# EAGLE schematic SOM EVAL BOARD V1.1 (EAGLE 9.4.2)

## Sheet 1 of 3
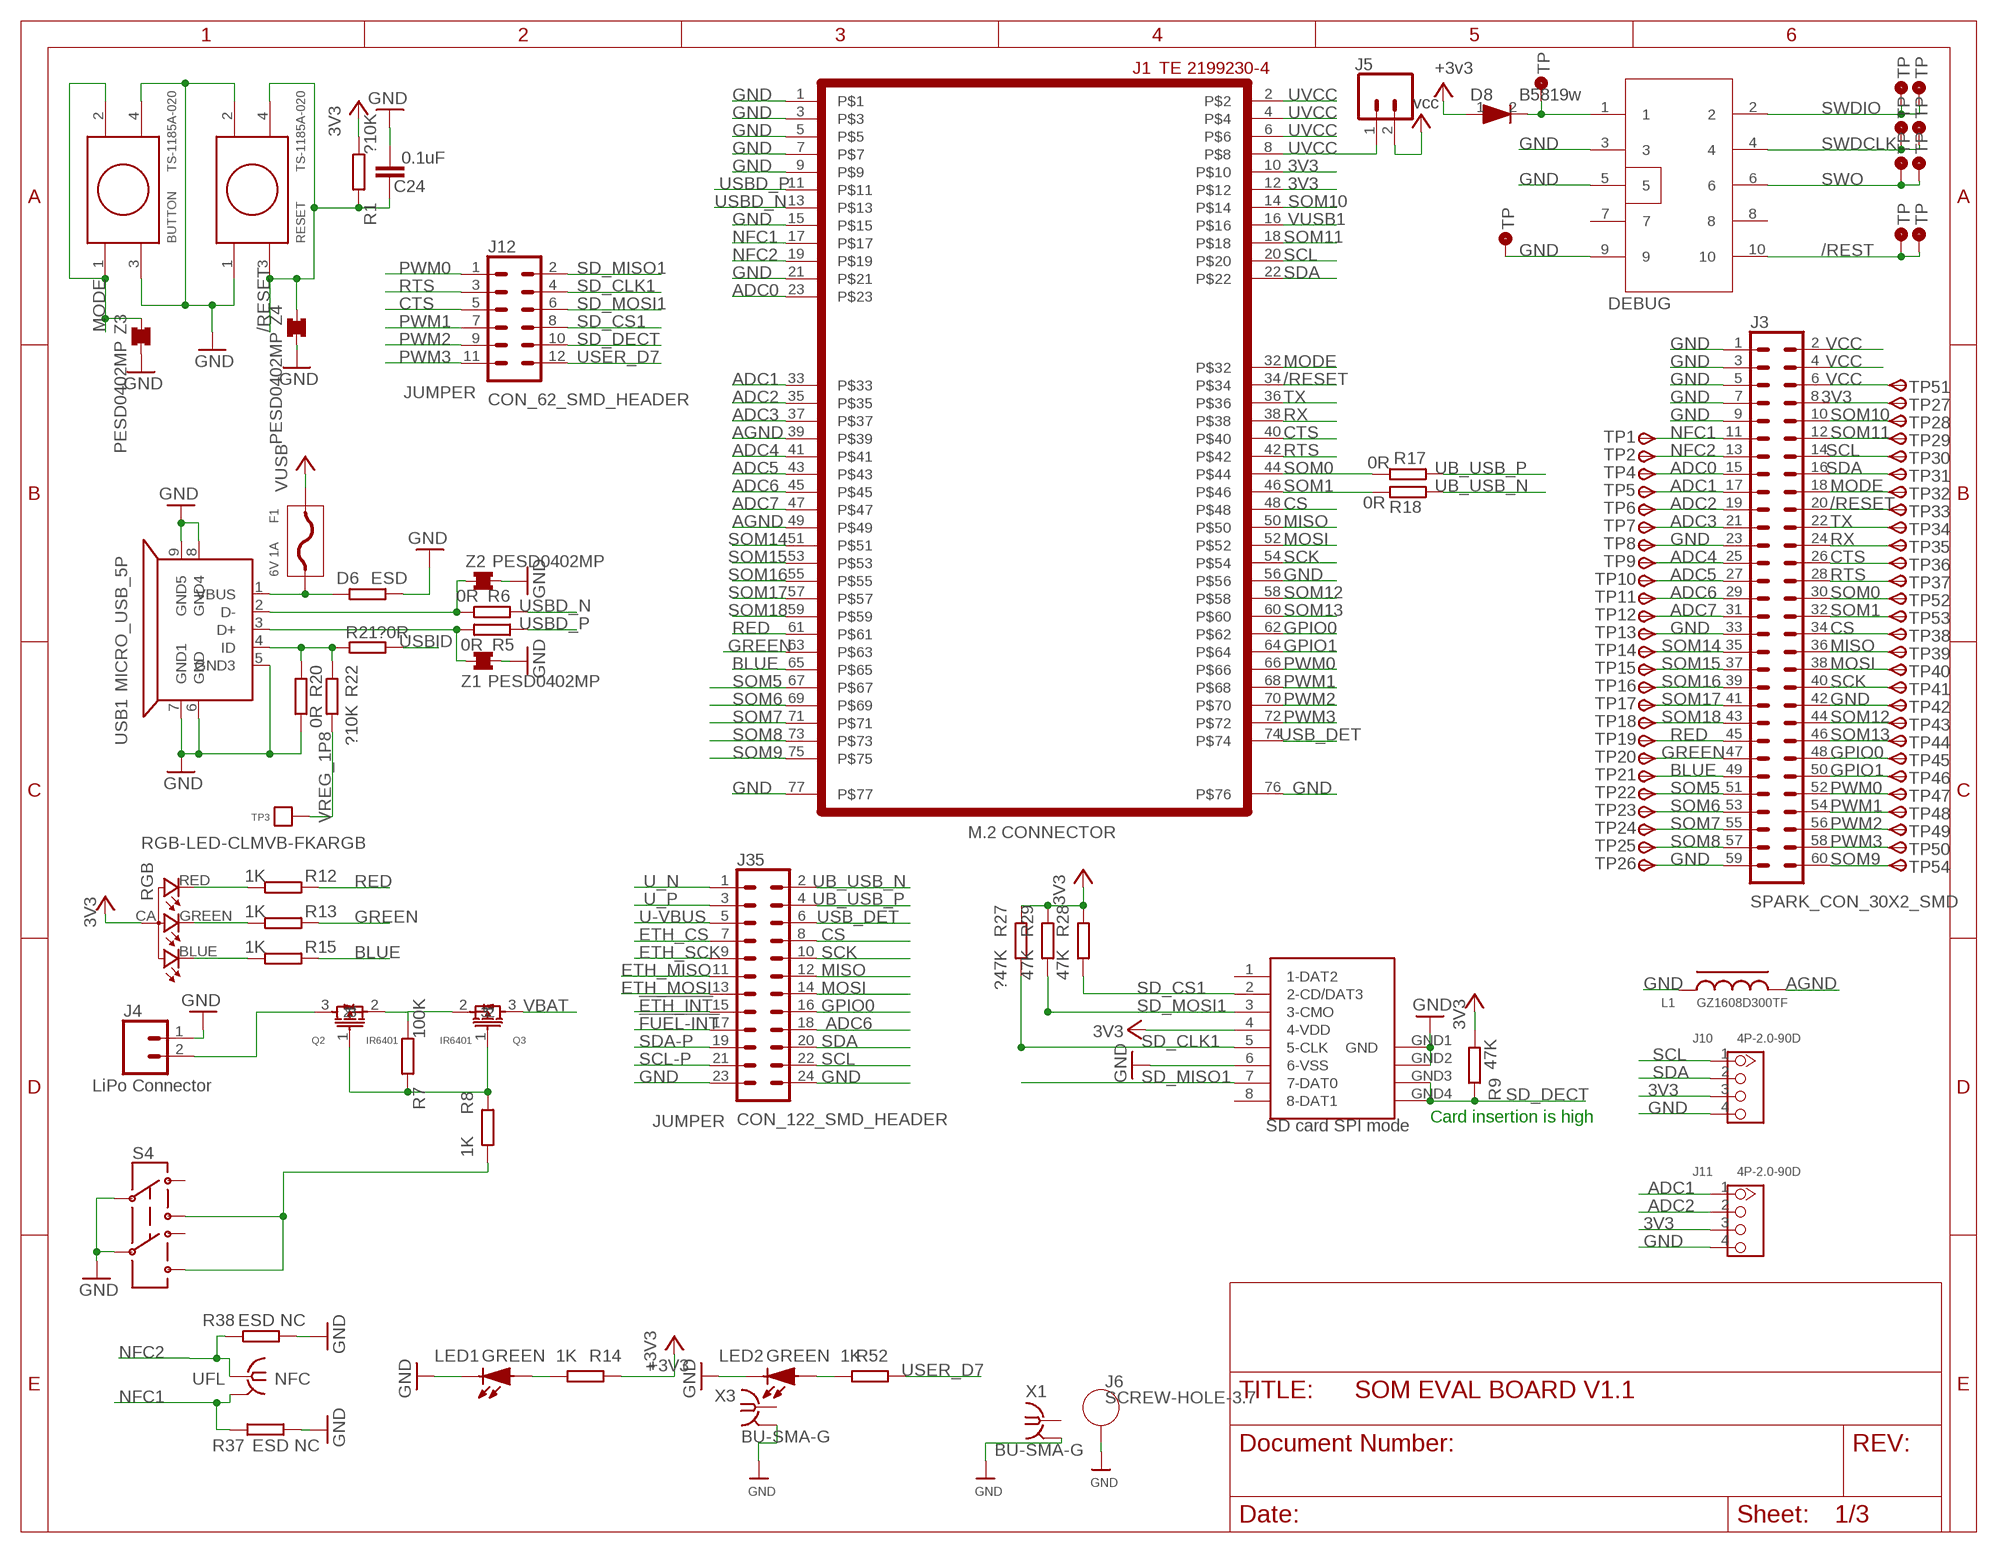
[diagram p0: schematic, sheet 1]

### Parts
BUTTON  TS-1185A-020  [TS-1185A-020]
C24  0.1uF  CAP_1  [C0402_B]
D6  ESD  RES0402S  [R-0402S]
D8  B5819w  DIODESOD123  [SOD-123]
DEBUG  CON5X2  [CON5X2_1.27]
F1  6V 1A  FUSE  [F0805]
J1  TE 2199230-4  M.2EKEY  [M.2EKEY]
J3  SPARK_CON_30X2_SMD  [SPARK_CON_30X2_SMD]
J4  CONN_02-JST-2MM-SMT  [JST-2-SMD]
J5  CONN_02  [1X02]
J6  SCREW-HOLE-3.7  [SCREW-HOLE-3.7]
J10  4P-2.0-90D  GROVE-CONNECTOR-DIP-90D(4P-2.0)  [HW4-2.0-90D]
J11  4P-2.0-90D  GROVE-CONNECTOR-DIP-90D(4P-2.0)  [HW4-2.0-90D]
J12  CON_62_SMD_HEADER  [CON_6*2_SMD_HEADER]
J35  CON_122_SMD_HEADER  [CON_12*2_SMD_HEADER]
L1  GZ1608D300TF  L  [R-0603A]
LED1  GREEN  LED  [LED0603]
LED2  GREEN  LED  [LED0603]
NFC  UFL  IPEX-20279-001E  [IPEX-20279-001E]
P1  SPARK_POGOPIN  [SPARK_POGO-2.0]
P2  SPARK_POGOPIN  [SPARK_POGO-2.0]
P3  SPARK_POGOPIN  [SPARK_POGO-2.0]
P4  SPARK_POGOPIN  [SPARK_POGO-2.0]
Q2  IR6401  PMOS  [SOT-23]
Q3  IR6401  PMOS  [SOT-23]
R1  ?10K  RES0402S  [R-0402S]
R5  0R  RES0402S  [R-0402S]
R6  0R  RES0402S  [R-0402S]
R7  100K  RESR0603  [R0603]
R8  1K  RES0402S  [R-0402S]
R9  47K  RES0402S  [R-0402S]
R12  1K  RES0402S  [R-0402S]
R13  1K  RES0402S  [R-0402S]
R14  1K  RES0402S  [R-0402S]
R15  1K  RES0402S  [R-0402S]
R17  0R  RES0402S  [R-0402S]
R18  0R  RES0402S  [R-0402S]
R20  0R  RES0402S  [R-0402S]
R21  ?0R  RES0402S  [R-0402S]
R22  ?10K  RES0402S  [R-0402S]
R27  ?47K  RES0402S  [R-0402S]
R28  47K  RES0402S  [R-0402S]
R29  47K  RES0402S  [R-0402S]
R37  ESD NC  RES0402S  [R-0402S]
R38  ESD NC  RES0402S  [R-0402S]
R52  1K  RES0402S  [R-0402S]
RESET  TS-1185A-020  [TS-1185A-020]
RGB  RGB-LED-CLMVB-FKARGB  [PLCC4-2MM-RGB]
S4  SWITCH-DPDT  [SWITCH-2.5X3.2-6]
TP1  TPSB1,27  [B1,27]
TP2  TPSB1,27  [B1,27]
TP3  TPTP  [TP]
TP4  TPSB1,27  [B1,27]
TP5  TPSB1,27  [B1,27]
TP6  TPSB1,27  [B1,27]
TP7  TPSB1,27  [B1,27]
TP8  TPSB1,27  [B1,27]
TP9  TPSB1,27  [B1,27]
TP10  TPSB1,27  [B1,27]
TP11  TPSB1,27  [B1,27]
TP12  TPSB1,27  [B1,27]
TP13  TPSB1,27  [B1,27]
TP14  TPSB1,27  [B1,27]
TP15  TPSB1,27  [B1,27]
TP16  TPSB1,27  [B1,27]
TP17  TPSB1,27  [B1,27]
TP18  TPSB1,27  [B1,27]
TP19  TPSB1,27  [B1,27]
TP20  TPSB1,27  [B1,27]
TP21  TPSB1,27  [B1,27]
TP22  TPSB1,27  [B1,27]
TP23  TPSB1,27  [B1,27]
TP24  TPSB1,27  [B1,27]
TP25  TPSB1,27  [B1,27]
TP26  TPSB1,27  [B1,27]
TP27  TPSB1,27  [B1,27]
TP28  TPSB1,27  [B1,27]
TP29  TPSB1,27  [B1,27]
TP30  TPSB1,27  [B1,27]
TP31  TPSB1,27  [B1,27]
TP32  TPSB1,27  [B1,27]
TP33  TPSB1,27  [B1,27]
TP34  TPSB1,27  [B1,27]
TP35  TPSB1,27  [B1,27]
TP36  TPSB1,27  [B1,27]
TP37  TPSB1,27  [B1,27]
TP38  TPSB1,27  [B1,27]
TP39  TPSB1,27  [B1,27]
TP40  TPSB1,27  [B1,27]
TP41  TPSB1,27  [B1,27]
TP42  TPSB1,27  [B1,27]
TP43  TPSB1,27  [B1,27]
TP44  TPSB1,27  [B1,27]
TP45  TPSB1,27  [B1,27]
TP46  TPSB1,27  [B1,27]
TP47  TPSB1,27  [B1,27]
TP48  TPSB1,27  [B1,27]
TP49  TPSB1,27  [B1,27]
TP50  TPSB1,27  [B1,27]
TP51  TPSB1,27  [B1,27]
TP52  TPSB1,27  [B1,27]
TP53  TPSB1,27  [B1,27]
TP54  TPSB1,27  [B1,27]
U$1  TP2  [TP70_BOT]
U$2  TP2  [TP70_BOT]
U$9  TP2  [TP70_BOT]
U$10  TP2  [TP70_BOT]
U$11  TP2  [TP70_BOT]
U$12  TP2  [TP70_BOT]
USB1  MICRO_USB_5P  MICRO_USBMICRO_USB  [MICRO_USB]
X1  BU-SMA-G  [BU-SMA-G]
X3  BU-SMA-G  [BU-SMA-G]
X4  0046_15TW-882  [SDCARD-15TW-8821]
Z1  PESD0402MP  [SMD-0402MP]
Z2  PESD0402MP  [SMD-0402MP]
Z3  PESD0402MP  [SMD-0402MP]
Z4  PESD0402MP  [SMD-0402MP]

### Nets
3V3: J1.10 J1.12 J3.8 J10.3 J11.3 R1.2 R9.2 R27.1 R28.1 R29.1 RGB.CA TP27.TP(PP) X4.4(4-VDD) ; also sheet 2
!ETH_INT: J35.15 ; also sheet 3
!FUEL-INT: J35.17 ; also sheet 2
+3V3: D8.1 R14.1 ; supply symbol labelled +3v3 ; also sheet 2,3
/RESET: C24.2 J1.34 J3.20 R1.1 RESET.3 RESET.4 TP33.TP(PP) Z4.2
/REST: DEBUG.10 P4.P$2(TP) U$12.P$1(TP)
ADC0: J1.23 J3.15 TP4.TP(PP)
ADC1: J1.33 J3.17 J11.1 TP5.TP(PP)
ADC2: J1.35 J3.19 J11.2 TP6.TP(PP)
ADC3: J1.37 J3.21 TP7.TP(PP)
ADC4: J1.41 J3.25 TP9.TP(PP)
ADC5: J1.43 J3.27 TP10.TP(PP)
ADC6: J1.45 J3.29 J35.18 TP11.TP(PP)
ADC7: J1.47 J3.31 TP12.TP(PP) ; also sheet 3
AGND: J1.39 J1.49 L1.2
BLUE: J1.65 J3.49 R15.1 TP21.TP(PP)
CS: J1.48 J3.34 J35.8 TP38.TP(PP)
CTS: J1.40 J3.26 J12.5 TP36.TP(PP)
D+: R5.2 USB1.3(D+) Z1.2
D-: R6.2 USB1.2(D-) Z2.2
ETH_CS: J35.7 ; also sheet 3
ETH_MISO: J35.11 ; also sheet 3
ETH_MOSI: J35.13 ; also sheet 3
ETH_SCK: J35.9 ; also sheet 3
GND: BUTTON.3 BUTTON.4 C24.1 D6.1 DEBUG.3 DEBUG.5 DEBUG.9 J1.1 J1.3 J1.5 J1.7 J1.9 J1.15 J1.21 J1.56 J1.76 J1.77 J3.1 J3.3 J3.5 J3.7 J3.9 J3.23 J3.33 J3.42 J3.59 J4.1 J6.P$1(GND) J10.4 J11.4 J35.23 J35.24 L1.1 LED1.2(K) LED2.2(K) R20.2 R37.2 R38.1 RESET.1 RESET.2 S4.2 S4.5 TP8.TP(PP) TP13.TP(PP) TP26.TP(PP) TP42.TP(PP) U$2.P$1(TP) USB1.5(GND3) USB1.6(GND) USB1.7(GND1) USB1.8(GND4) USB1.9(GND5) X1.2 X1.3 X1.4 X1.5 X3.2 X3.3 X3.4 X3.5 X4.6(6-VSS) X4.GND1(GND) X4.GND2(GND1) Z1.1 Z2.1 Z3.1 Z4.1 ; also sheet 2,3
GPIO0: J1.62 J3.48 J35.16 TP45.TP(PP)
GPIO1: J1.64 J3.50 TP46.TP(PP)
GREEN: J1.63 J3.47 R13.1 TP20.TP(PP)
MISO: J1.50 J3.36 J35.12 TP39.TP(PP)
MODE: BUTTON.1 BUTTON.2 J1.32 J3.18 TP32.TP(PP) Z3.2
MOSI: J1.52 J3.38 J35.14 TP40.TP(PP)
N$1: R20.1 R21.1 R22.1 USB1.4(ID)
N$2: R12.2 RGB.RED
N$9: R8.2 S4.3 S4.6
N$10: D8.2 DEBUG.1 U$1.P$1(TP)
N$14: J4.2 Q2.3
N$18: D6.2 F1.P$1 USB1.1(VBUS)
N$19: LED1.1(A) R14.2
N$26: R15.2 RGB.BLUE
N$27: R13.2 RGB.GREEN
N$36: LED2.1(A) R52.2
N$46: Q2.2 Q3.2 R7.2
N$47: Q2.1 Q3.1 R7.1 R8.1
NFC1: J1.17 J3.11 NFC.2@1(GND) NFC.2@2(GND) R37.1 TP1.TP(PP)
NFC2: J1.19 J3.13 NFC.1 R38.2 TP2.TP(PP)
PWM0: J1.66 J3.52 J12.1 TP47.TP(PP)
PWM1: J1.68 J3.54 J12.7 TP48.TP(PP)
PWM2: J1.70 J3.56 J12.9 TP49.TP(PP)
PWM3: J1.72 J3.58 J12.11 TP50.TP(PP)
RED: J1.61 J3.45 R12.1 TP19.TP(PP)
RTS: J1.42 J3.28 J12.3 TP37.TP(PP)
RX: J1.38 J3.24 TP35.TP(PP)
SCK: J1.54 J3.40 J35.10 TP41.TP(PP)
SCL: J1.20 J3.14 J10.1 J35.22 TP30.TP(PP)
SCL-P: J35.21 ; also sheet 2
SD_CLK1: J12.4 R27.2 X4.5(5-CLK)
SD_CS1: J12.8 R28.2 X4.2(2-CD/DAT3)
SD_DECT: J12.10 R9.1 X4.GND3(GND2) X4.GND4(GND3)
SD_MISO1: J12.2 X4.7(7-DAT0)
SD_MOSI1: J12.6 R29.2 X4.3(3-CMO)
SDA: J1.22 J3.16 J10.2 J35.20 TP31.TP(PP)
SDA-P: J35.19 ; also sheet 2
SOM0: J1.44 J3.30 R17.2 TP52.TP(PP)
SOM1: J1.46 J3.32 R18.2 TP53.TP(PP)
SOM5: J1.67 J3.51 TP22.TP(PP)
SOM6: J1.69 J3.53 TP23.TP(PP)
SOM7: J1.71 J3.55 TP24.TP(PP)
SOM8: J1.73 J3.57 TP25.TP(PP)
SOM9: J1.75 J3.60 TP54.TP(PP)
SOM10: J1.14 J3.10 TP28.TP(PP)
SOM11: J1.18 J3.12 TP29.TP(PP)
SOM12: J1.58 J3.44 TP43.TP(PP)
SOM13: J1.60 J3.46 TP44.TP(PP)
SOM14: J1.51 J3.35 TP14.TP(PP)
SOM15: J1.53 J3.37 TP15.TP(PP)
SOM16: J1.55 J3.39 TP16.TP(PP)
SOM17: J1.57 J3.41 TP17.TP(PP)
SOM18: J1.59 J3.43 TP18.TP(PP)
SWDCLK: DEBUG.4 P2.P$2(TP) U$10.P$1(TP)
SWDIO: DEBUG.2 P1.P$2(TP) U$9.P$1(TP)
SWO: DEBUG.6 P3.P$2(TP) U$11.P$1(TP)
TX: J1.36 J3.22 TP34.TP(PP)
U-VBUS: J35.5 ; also sheet 2
U_N: J35.1 ; also sheet 2
U_P: J35.3 ; also sheet 2
UB_USB_N: J35.2 R18.1
UB_USB_P: J35.4 R17.1
USB_DET: J1.74 J35.6
USBD_N: J1.13 R6.1 ; also sheet 2
USBD_P: J1.11 R5.1 ; also sheet 2
USBID: R21.2
USER_D7: J12.12 R52.1
UVCC: J1.2 J1.4 J1.6 J1.8 J5.1
VBAT: Q3.3 ; also sheet 2
VCC: J3.2 J3.4 J3.6 J5.2 TP51.TP(PP) ; supply symbol labelled vcc ; also sheet 2
VREG_1P8: R22.2 TP3.P$1
VUSB: F1.P$2 ; also sheet 2
VUSB1: J1.16 ; also sheet 2
Unconnected: DEBUG.7 DEBUG.8 S4.1 S4.4 X1.1 X3.1 X4.1(1-DAT2) X4.8(8-DAT1)

### Notes on the sheet
- JUMPER
- M.2 CONNECTOR
- LiPo Connector
- JUMPER | Card insertion is high
- SD card SPI mode

## Sheet 2 of 3
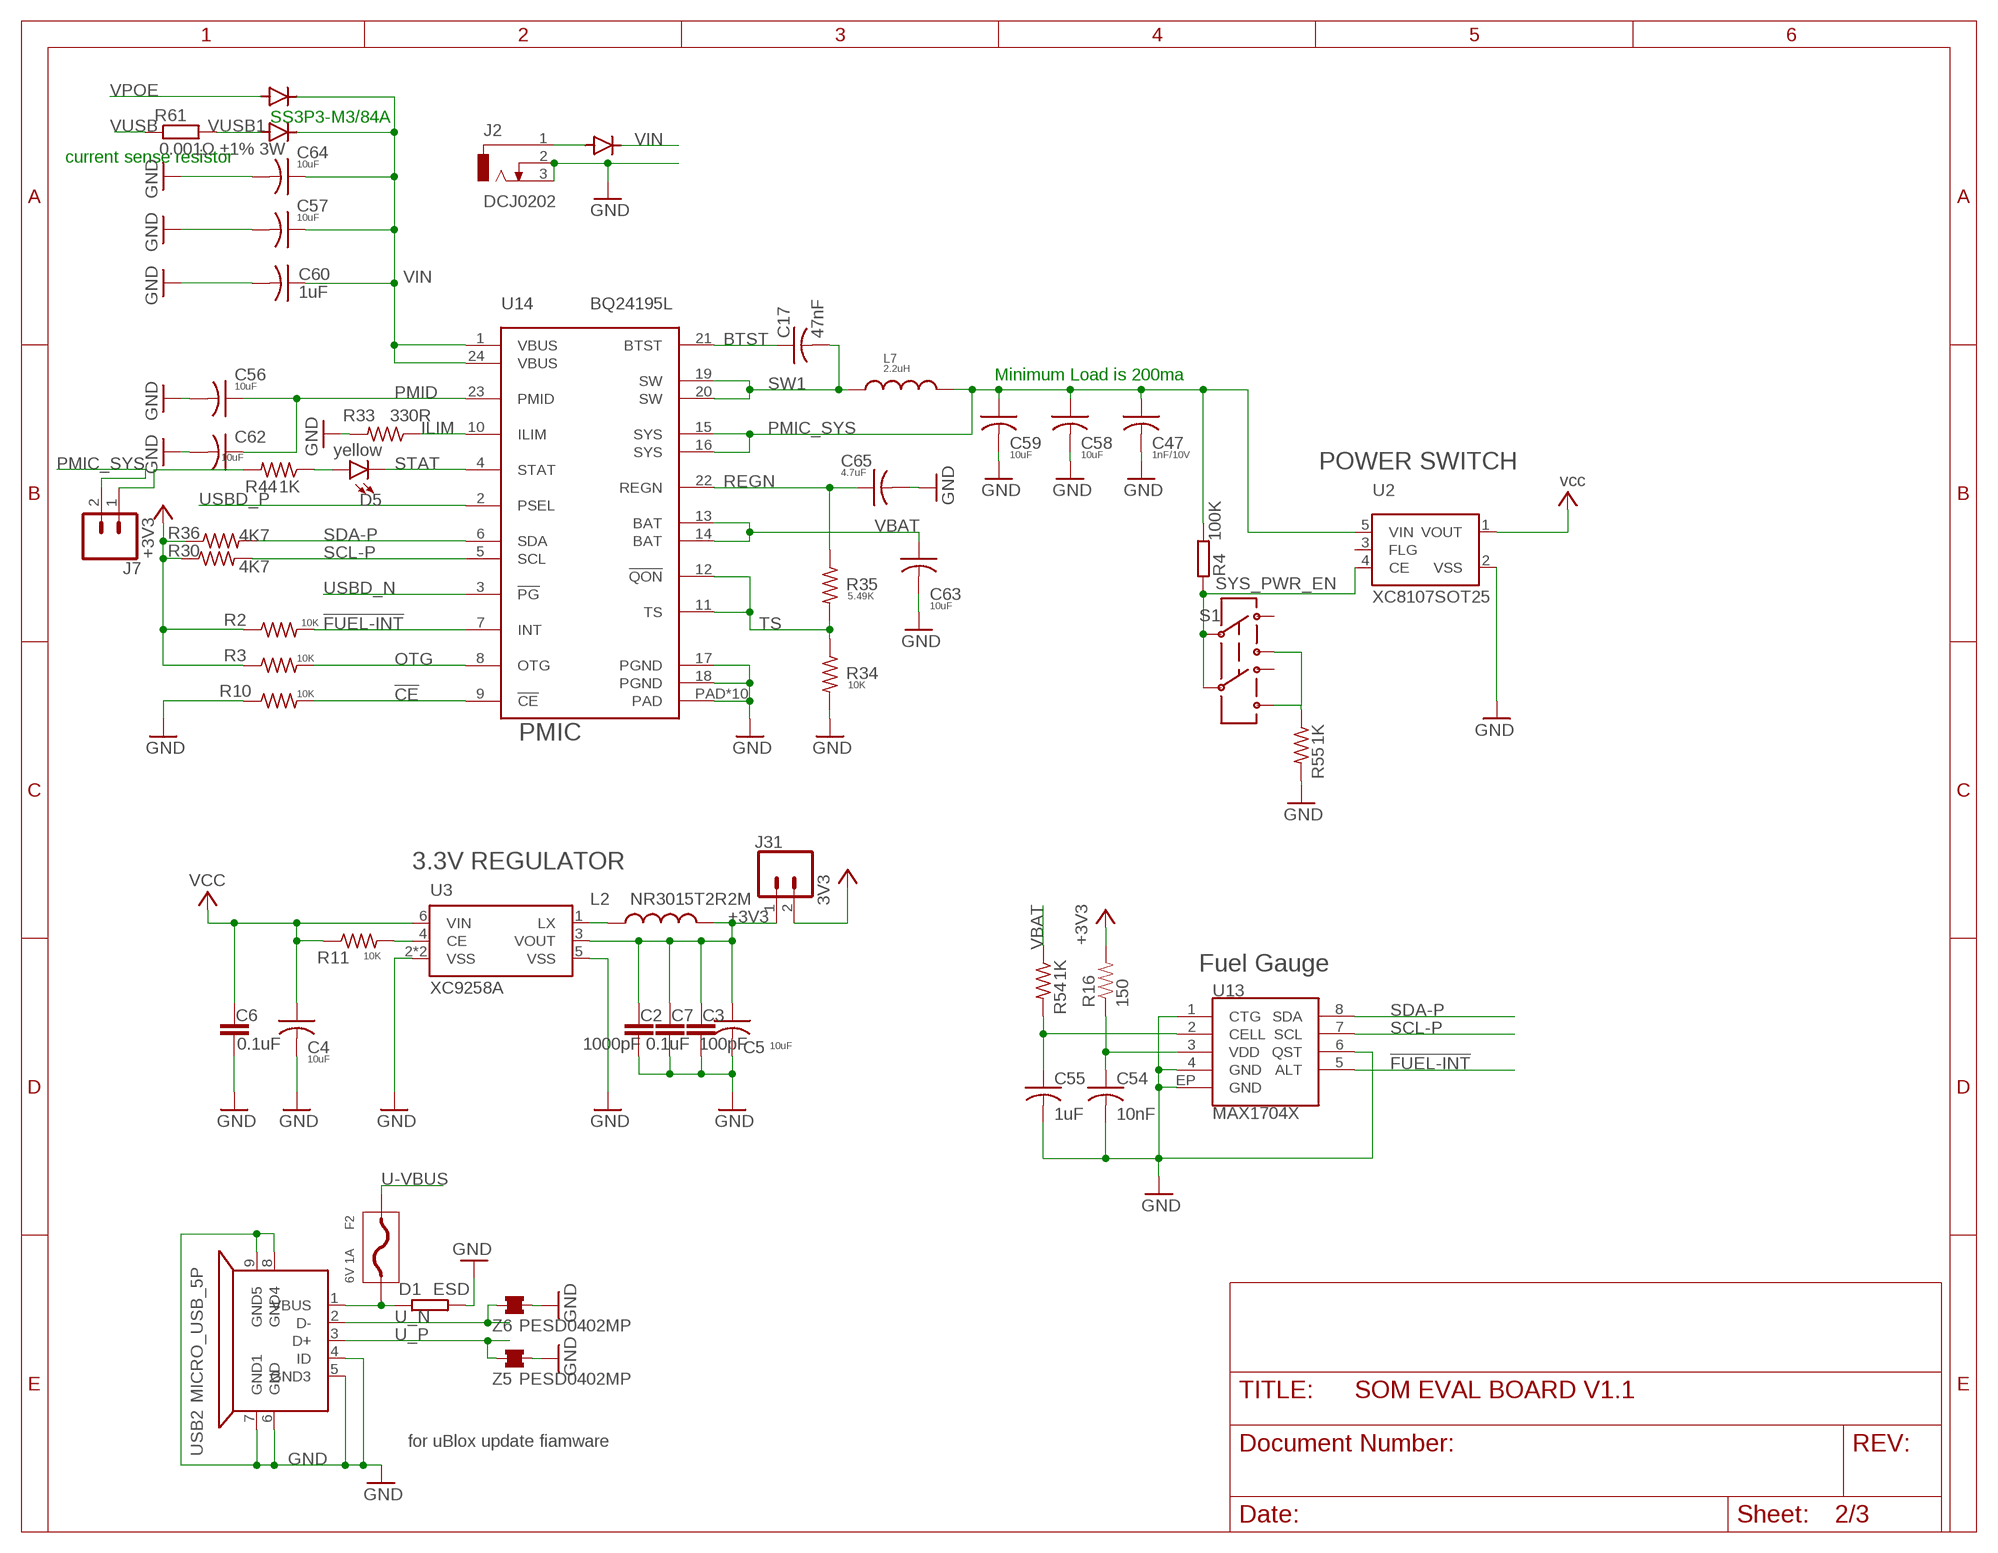
[diagram p1: schematic, sheet 2]

### Parts
C2  1000pF  CAP_1  [C0402_B]
C3  100pF  CAP_1  [C0402_B]
C4  10uF  C-US0603  [C0603_B]
C5  10uF  C-US0603  [C0603_B]
C6  0.1uF  CAP_1  [C0402_B]
C7  0.1uF  CAP_1  [C0402_B]
C17  47nF  C-USC0201_B  [C0201_B]
C47  1nF/10V  C-US0402  [C0402_B]
C54  10nF  C-US  [C0402_B]
C55  1uF  C-US  [C0402_B]
C56  10uF  C-US0603  [C0603_B]
C57  10uF  C-US0603  [C0603_B]
C58  10uF  C-US0603  [C0603_B]
C59  10uF  C-US0603  [C0603_B]
C60  1uF  C-US  [C0402_B]
C62  10uF  C-US0603  [C0603_B]
C63  10uF  C-US0603  [C0603_B]
C64  10uF  C-US0603  [C0603_B]
C65  4.7uF  C-US0603  [C0603_B]
D1  ESD  RES0402S  [R-0402S]
D3  SS3P3-M3/84A  DIODE_NT  [DIODE-DO-220AA_NT(SMP)]
D4  SS3P3-M3/84A  DIODE_NT  [DIODE-DO-220AA_NT(SMP)]
D5  yellow  LED-RED0603  [LED-0603]
D7  SS3P3-M3/84A  DIODE_NT  [DIODE-DO-220AA_NT(SMP)]
F2  6V 1A  FUSE  [F0805]
J2  DCJ0202  [DCJ0202]
J7  CONN_02  [1X02]
J31  CONN_02  [1X02]
L2  NR3015T2R2M  INDUCTOR-SPARKFUNVLS3012ET-4R7M  [INDUCTOR-VLS-E]
L7  2.2uH  INDUCTORI  [INDUCTOR-4040]
R2  10K  R-US_  [R0402_B]
R3  10K  R-US_  [R0402_B]
R4  100K  RESR0603  [R0603]
R10  10K  R-US_  [R0402_B]
R11  10K  R-US_  [R0402_B]
R16  150  RESISTOR0402-RES  [0402-RES]
R30  4K7  R-US_R0201_B  [C0201_B]
R33  330R  R-US_  [R0402_B]
R34  10K  R-US_  [R0402_B]
R35  5.49K  R-US_  [R0402_B]
R36  4K7  R-US_R0201_B  [C0201_B]
R44  1K  R-US_  [R0402_B]
R54  1K  R-US_  [R0402_B]
R55  1K  R-US_  [R0402_B]
R61  0.001Ω ±1% 3W  R-EU_R2512  [R2512]
S1  SWITCH-DPDT  [SWITCH-2.5X3.2-6]
U2  XC8107SOT25  [SOT25]
U3  XC9258A  XC9258A33EER-G  [USP-6C]
U13  MAX1704X  [TDFN-8]
U14  BQ24195L  BQ24298RTWR  [QFN24]
USB2  MICRO_USB_5P  MICRO_USBMICRO_USB  [MICRO_USB]
Z5  PESD0402MP  [SMD-0402MP]
Z6  PESD0402MP  [SMD-0402MP]

### Nets
3V3: J31.2 ; also sheet 1
!CE: R10.2 U14.9(!CE)
!FUEL-INT: R2.2 U13.5(ALT) U14.7(INT) ; also sheet 1
+3V3: C2.2 C3.2 C5.1 C7.2 J31.1 L2.P$2 R2.1 R3.1 R16.2 R30.1 R36.1 U3.3(VOUT) ; also sheet 1,3
BTST: C17.1 U14.21(BTST)
GND: C2.1 C3.1 C4.2 C5.2 C6.1 C7.1 C47.2 C54.2 C55.2 C56.2 C57.2 C58.2 C59.2 C60.2 C62.2 C63.2 C64.2 C65.2 D1.1 J2.2 J2.3 R10.1 R33.2 R34.2 R55.2 U2.2(VSS) U3.2(VSS) U3.5(VSS) U3.P$1(VSS) U13.1(CTG) U13.4(GND) U13.6(QST) U13.EP(GND) U14.17(PGND) U14.18(PGND) U14.PAD U14.PAD@1(PAD) U14.PAD@2(PAD) U14.PAD@3(PAD) U14.PAD@4(PAD) U14.PAD@5(PAD) U14.PAD@6(PAD) U14.PAD@7(PAD) U14.PAD@8(PAD) U14.PAD@9(PAD) USB2.4(ID) USB2.5(GND3) USB2.6(GND) USB2.7(GND1) USB2.8(GND4) USB2.9(GND5) Z5.1 Z6.1 ; also sheet 1,3
ILIM: R33.1 U14.10(ILIM)
N$3: D5.A R44.1
N$4: J7.1 R44.2
N$5: D1.2 F2.P$1 USB2.1(VBUS)
N$6: L2.P$1 U3.1(LX)
N$7: R11.2 U3.4(CE)
N$38: R55.1 S1.3 S1.6
N$45: D7.ANODE J2.1
N$48: C54.1 R16.1 U13.3(VDD)
N$49: C55.1 R54.2 U13.2(CELL)
OTG: R3.2 U14.8(OTG)
PMIC_SYS: C47.1 C58.1 C59.1 J7.2 L7.P$2 R4.2 U2.5(VIN) U14.15(SYS) U14.16(SYS)
PMID: C56.1 C62.1 U14.23(PMID)
REGN: C65.1 R35.1 U14.22(REGN)
SCL-P: R30.2 U13.7(SCL) U14.5(SCL) ; also sheet 1
SDA-P: R36.2 U13.8(SDA) U14.6(SDA) ; also sheet 1
STAT: D5.C U14.4(STAT)
SW1: C17.2 L7.P$1 U14.19(SW) U14.20(SW)
SYS_PWR_EN: R4.1 S1.2 S1.5 U2.4(CE)
TS: R34.1 R35.2 U14.11(TS) U14.12(!QON)
U-VBUS: F2.P$2 ; also sheet 1
U_N: USB2.2(D-) Z6.2 ; also sheet 1
U_P: USB2.3(D+) Z5.2 ; also sheet 1
USBD_N: U14.3(!PG) ; also sheet 1
USBD_P: U14.2(PSEL) ; also sheet 1
VBAT: C63.1 R54.1 U14.13(BAT) U14.14(BAT) ; also sheet 1
VCC: C4.1 C6.2 R11.1 U2.1(VOUT) U3.6(VIN) ; supply symbol labelled vcc ; also sheet 1
VIN [power]: C57.1 C60.1 C64.1 D3.CATHODE D4.CATHODE D7.CATHODE U14.1(VBUS) U14.24(VBUS)
VPOE: D3.ANODE ; also sheet 3
VUSB: R61.1 ; also sheet 1
VUSB1: D4.ANODE R61.2 ; also sheet 1
Unconnected: S1.1 S1.4 U2.3(FLG)

### Notes on the sheet
- SS3P3-M3/84A
- current sense resistor
- Minimum Load is 200ma
- POWER SWITCH
- PMIC
- 3.3V REGULATOR
- Fuel Gauge
- for uBlox update fiamware

## Sheet 3 of 3
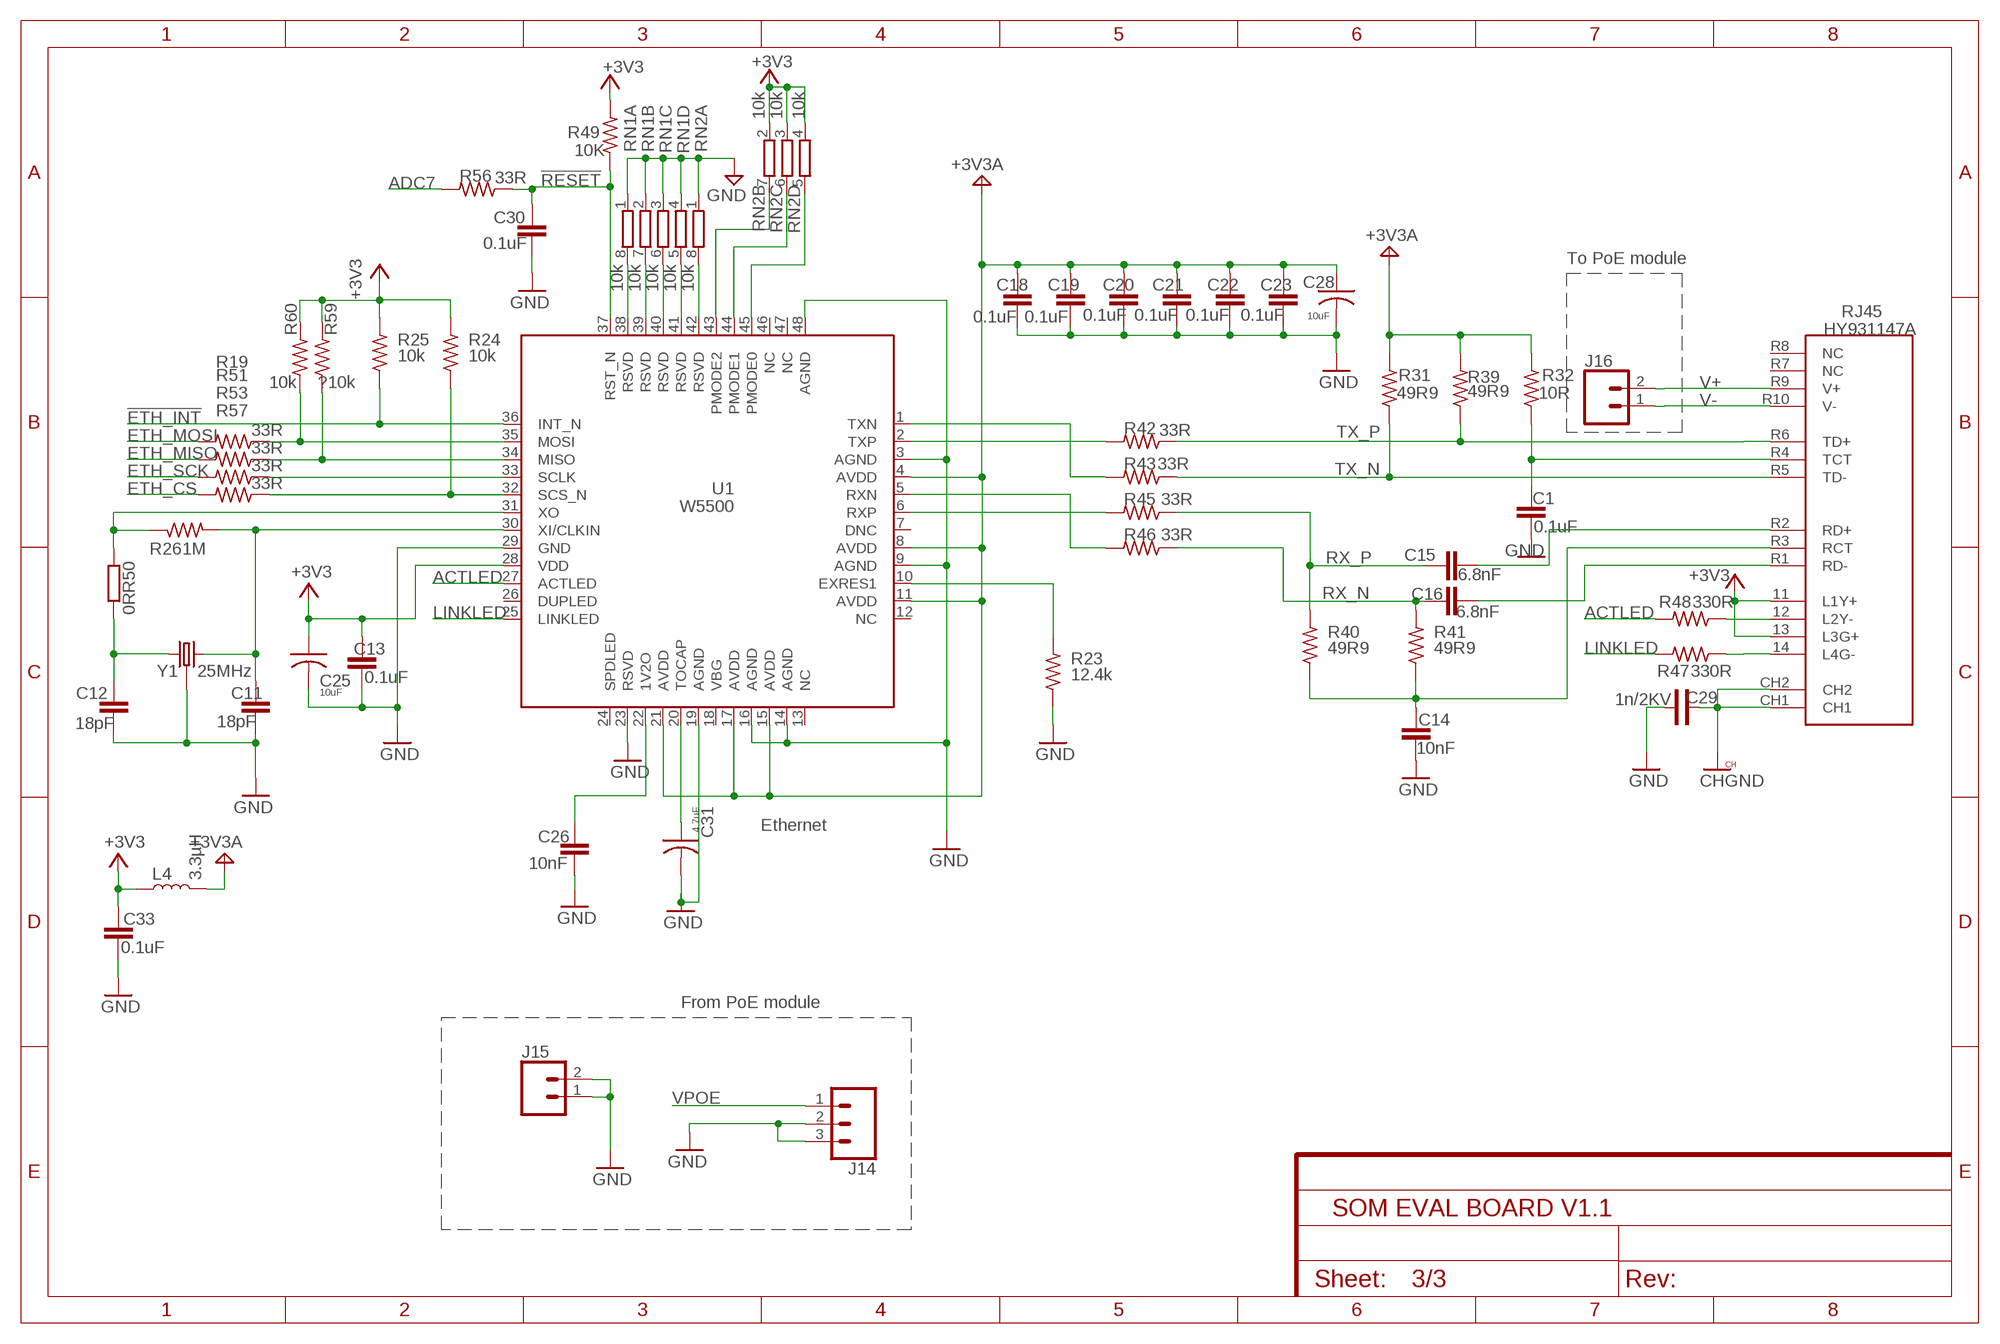
[diagram p2: schematic, sheet 3]

### Parts
C1  0.1uF  CAP_1  [C0402_B]
C11  18pF  CAP_1  [C0402_B]
C12  18pF  CAP_1  [C0402_B]
C13  0.1uF  CAP_1  [C0402_B]
C14  10nF  CAP_1  [C0402_B]
C15  6.8nF  CAP_1  [C0402_B]
C16  6.8nF  CAP_1  [C0402_B]
C18  0.1uF  CAP_1  [C0402_B]
C19  0.1uF  CAP_1  [C0402_B]
C20  0.1uF  CAP_1  [C0402_B]
C21  0.1uF  CAP_1  [C0402_B]
C22  0.1uF  CAP_1  [C0402_B]
C23  0.1uF  CAP_1  [C0402_B]
C25  10uF  C-US0603  [C0603_B]
C26  10nF  CAP_1  [C0402_B]
C28  10uF  C-US0603  [C0603_B]
C29  1n/2KV  C-1808  [C-1808]
C30  0.1uF  CAP_1  [C0402_B]
C31  4.7uF  C-US0603  [C0603_B]
C33  0.1uF  CAP_1  [C0402_B]
J14  CONN_03  [1X03]
J15  CONN_02  [1X02]
J16  CONN_02  [1X02]
L4  3.3µH  INDUCTOR-0805-3.3UH  [0805]
R19  33R  R-US_  [R0402_B]
R23  12.4k  R-US_  [R0402_B]
R24  10k  R-US_  [R0402_B]
R25  10k  R-US_  [R0402_B]
R26  1M  R-US_  [R0402_B]
R31  49R9  R-US_  [R0402_B]
R32  10R  R-US_  [R0402_B]
R39  49R9  R-US_  [R0402_B]
R40  49R9  R-US_  [R0402_B]
R41  49R9  R-US_  [R0402_B]
R42  33R  R-US_  [R0402_B]
R43  33R  R-US_  [R0402_B]
R45  33R  R-US_  [R0402_B]
R46  33R  R-US_  [R0402_B]
R47  330R  R-US_  [R0402_B]
R48  330R  R-US_  [R0402_B]
R49  10K  R-US_  [R0402_B]
R50  0R  RES0402S  [R-0402S]
R51  33R  R-US_  [R0402_B]
R53  33R  R-US_  [R0402_B]
R56  33R  R-US_  [R0402_B]
R57  33R  R-US_  [R0402_B]
R59  ?10k  R-US_  [R0402_B]
R60  10k  R-US_  [R0402_B]
RJ45  HY931147A  ARDUINO-ETHERNET-SHIELD2-V2_POE_RJ45  [ARDUINO-ETHERNET-SHIELD2-V2_CONNETTORI_POE-RJ45]
RN1  10k  4R-N0402ARV341  [4X0402ARV341]
RN2  10k  4R-N0402ARV341  [4X0402ARV341]
U1  W5500  [W5500]
Y1  25MHz  CRYSTAL-GROUNDEDSMD-3.2X2.5  [CRYSTAL-SMD-3.2X2.5MM]

### Nets
!ETH_INT: R25.1 U1.36(INT_N) ; also sheet 1
!RESET: C30.2 R49.1 R56.1 U1.37(RST_N)
+3V3: C13.2 C25.1 C33.2 L4.1 R24.2 R25.2 R49.2 R59.2 R60.2 RJ45.11(L1Y+) RJ45.13(L3G+) RN2.2 RN2.3 RN2.4 U1.28(VDD) ; also sheet 1,2
+3V3A: C18.2 C19.2 C20.2 C21.2 C22.2 C23.2 C28.1 L4.2 R31.2 R32.2 R39.2 U1.4(AVDD) U1.8(AVDD) U1.11(AVDD) U1.15(AVDD) U1.17(AVDD) U1.21(AVDD)
ACTLED: R48.2 U1.27(ACTLED)
ADC7: R56.2 ; also sheet 1
CHGND: C29.P$1 RJ45.CH1 RJ45.CH2
ETH_CS: R57.2 ; also sheet 1
ETH_MISO: R51.2 ; also sheet 1
ETH_MOSI: R19.2 ; also sheet 1
ETH_SCK: R53.2 ; also sheet 1
GND: C1.1 C11.1 C12.1 C13.1 C14.1 C18.1 C19.1 C20.1 C21.1 C22.1 C23.1 C25.2 C26.1 C28.2 C29.P$2 C30.1 C31.2 C33.1 J14.2 J14.3 J15.1 J15.2 R23.1 RN1.1 RN1.2 RN1.3 RN1.4 RN2.1 U1.3(AGND) U1.9(AGND) U1.14(AGND) U1.16(AGND) U1.19(AGND) U1.23(RSVD) U1.29(GND) U1.48(AGND) Y1.2 Y1.4 ; also sheet 1,2
LINKLED: R47.2 U1.25(LINKLED)
N$8: R19.1 R60.1 U1.35(MOSI)
N$11: R51.1 R59.1 U1.34(MISO)
N$12: RN1.8 U1.38(RSVD)
N$13: R53.1 U1.33(SCLK)
N$15: RN1.7 U1.39(RSVD)
N$16: RN1.6 U1.40(RSVD)
N$17: RN1.5 U1.41(RSVD)
N$20: RN2.8 U1.42(RSVD)
N$21: R24.1 R57.1 U1.32(SCS_N)
N$22: RN2.7 U1.43(PMODE2)
N$23: RN2.6 U1.44(PMODE1)
N$24: RN2.5 U1.45(PMODE0)
N$25: C26.2 U1.22(1V2O)
N$28: R23.2 U1.10(EXRES1)
N$29: C1.2 R32.1 RJ45.R4(TCT)
N$30: C14.2 R40.1 R41.1 RJ45.R3(RCT)
N$31: R26.1 R50.1 U1.31(XO)
N$32: C11.2 R26.2 U1.30(XI/CLKIN) Y1.3
N$33: C12.2 R50.2 Y1.1
N$35: C31.1 U1.20(TOCAP)
N$37: R48.1 RJ45.12(L2Y-)
N$87: R47.1 RJ45.14(L4G-)
R_N: R46.2 U1.5(RXN)
R_P: R45.2 U1.6(RXP)
RR_N: C16.2 RJ45.R1(RD-)
RR_P: C15.2 RJ45.R2(RD+)
RX_N: C16.1 R41.2 R46.1
RX_P: C15.1 R40.2 R45.1
T_N: R43.2 U1.1(TXN)
T_P: R42.2 U1.2(TXP)
TX_N: R31.1 R43.1 RJ45.R5(TD-)
TX_P: R39.1 R42.1 RJ45.R6(TD+)
V+: J16.2 RJ45.R9(V+)
V-: J16.1 RJ45.R10(V-)
VPOE: J14.1 ; also sheet 2
Unconnected: RJ45.R7(NC) RJ45.R8(NC) U1.7(DNC) U1.12(NC) U1.13(NC) U1.18(VBG) U1.24(SPDLED) U1.26(DUPLED) U1.46(NC) U1.47(NC)

### Notes on the sheet
- To PoE module
- Ethernet
- From PoE module

## Library data of the parts
BUTTON RESET = RedBear DUO:TS-1185A-020
C1-C3 C6 C7 C11-C16 C18-C24 C26 C30 C33 = Particle:CAP_1
C4 C5 C25 C28 C31 C47 C56-C59 C62-C65 = Bretts-Spark-Library:C-US: Capacitor
C17 = Particle:C-US: Capacitor
C29 = CAP:C-1808
C54 C55 C60 = Spark:C-US: Capacitor
D1 D6 R1 R4-R9 R12-R15 R17 R18 R20-R22 R27-R29 R37 R38 R50 R52 = RedBear:RES: RES
D3 D4 D7 = Particle:DIODE
D5 = SparkFun-LED:LED-RED: Red SMD LED Used in manufacturing of most products at SparkFun Packages: 0603 - SMD 0603 package [Product Link] <http://docs.avagotech.com/docs/AV02-0551EN> 0603 SMART - SMD 0603 SMART package ( more efficient and expensive)[Product Link] <http://www.osram-os.com/Graphics/XPic2/00077099_0.pdf> 1206 - SMD1206 package [Product Link] <https://www.sparkfun.com/datasheets/DevTools/LilyPad/Q150OVS4.pdff> SparkFun Products: Pro Mini 328 -5V <https://www.sparkfun.com/products/821> RedBoard <https://www.sparkfun.com/products/12757> IOIO-OTG <https://www.sparkfun.com/products/13613>; PROD_ID: DIO-00819; VALUE: RED
D8 = particle SZ:DIODE: DIODE
DEBUG = RedBear:CON5X2
F1 F2 = RedBear:FUSE
J1 = Spark:M.2EKEY
J2 = con-jack:DCJ0202: DC POWER JACK Source: DCJ0202.pdf; OC_FARNELL: unknown; OC_NEWARK: unknown
J3 = MESH SOM EVAL BOARD:SPARK_CON_30X2_SMD: CON30*2SMD
J4 = SparkFun-Connectors:CONN_02: Multi connection point. Often used as Generic Header-pin footprint for 0.1 inch spaced/style header connections On any of the 0.1 inch spaced packages, you can populate with these: Break Away Headers - Straight <https://www.sparkfun.com/products/116> (PRT-00116) Break Away Male Headers - Right Angle <https://www.sparkfun.com/products/553> (PRT-00553) Female Headers <https://www.sparkfun.com/products/115> (PRT-00115) Break Away Headers - Machine Pin <https://www.sparkfun.com/products/117> (PRT-00117) Break Away Female Headers - Swiss Machine Pin <https://www.sparkfun.com/products/743> (PRT-00743) For SCREWTERMINALS and SPRING TERMINALS visit here: Screw Terimnals on SparkFun.com <https://www.sparkfun.com/search/results?term=Screw+Terminals> (5mm/3.5mm/2.54mm spacing) This device is also useful as a general connection point to wire up your design to another part of your project. Our various solder wires solder well into these plated through hole pads. Hook-Up Wire - Assortment (Stranded, 22 AWG) <https://www.sparkfun.com/products/11375> (PRT-11375) Hook-Up Wire - Assortment (Solid Core, 22 AWG) <https://www.sparkfun.com/products/11367> (PRT-11367) View the entire wire category on our website here <https://www.sparkfun.com/categories/141> Special notes: Molex polarized connector foot print use with: PRT-08233 with associated crimp pins and housings. 2.54_SCREWTERM for use with PRT-10571. 3.5mm Screw Terminal footprints for PRT-08084 5mm Screw Terminal footprints for use with PRT-08432; PROD_ID: CONN-11443
J5 J7 J15 J16 J31 = SparkFun-Connectors:CONN_02: Multi connection point. Often used as Generic Header-pin footprint for 0.1 inch spaced/style header connections On any of the 0.1 inch spaced packages, you can populate with these: Break Away Headers - Straight <https://www.sparkfun.com/products/116> (PRT-00116) Break Away Male Headers - Right Angle <https://www.sparkfun.com/products/553> (PRT-00553) Female Headers <https://www.sparkfun.com/products/115> (PRT-00115) Break Away Headers - Machine Pin <https://www.sparkfun.com/products/117> (PRT-00117) Break Away Female Headers - Swiss Machine Pin <https://www.sparkfun.com/products/743> (PRT-00743) For SCREWTERMINALS and SPRING TERMINALS visit here: Screw Terimnals on SparkFun.com <https://www.sparkfun.com/search/results?term=Screw+Terminals> (5mm/3.5mm/2.54mm spacing) This device is also useful as a general connection point to wire up your design to another part of your project. Our various solder wires solder well into these plated through hole pads. Hook-Up Wire - Assortment (Stranded, 22 AWG) <https://www.sparkfun.com/products/11375> (PRT-11375) Hook-Up Wire - Assortment (Solid Core, 22 AWG) <https://www.sparkfun.com/products/11367> (PRT-11367) View the entire wire category on our website here <https://www.sparkfun.com/categories/141> Special notes: Molex polarized connector foot print use with: PRT-08233 with associated crimp pins and housings. 2.54_SCREWTERM for use with PRT-10571. 3.5mm Screw Terminal footprints for PRT-08084 5mm Screw Terminal footprints for use with PRT-08432
J6 = SOM EVAL BOARD V1.10:SCREW-HOLE-3.7: Screw,Drill diameter 2.6mm
J10 J11 = Seeed-Connector:GROVE-CONNECTOR-DIP-90D(4P-2.0): 320110034
J12 = Spark:CON_6*2_SMD_HEADER
J14 = SparkFun-Connectors:CONN_03: Multi connection point. Often used as Generic Header-pin footprint for 0.1 inch spaced/style header connections On any of the 0.1 inch spaced packages, you can populate with these: Break Away Headers - Straight <https://www.sparkfun.com/products/116> (PRT-00116) Break Away Male Headers - Right Angle <https://www.sparkfun.com/products/553> (PRT-00553) Female Headers <https://www.sparkfun.com/products/115> (PRT-00115) Break Away Headers - Machine Pin <https://www.sparkfun.com/products/117> (PRT-00117) Break Away Female Headers - Swiss Machine Pin <https://www.sparkfun.com/products/743> (PRT-00743) Stackable Header - 3 Pin (Female, 0.1") <https://www.sparkfun.com/products/13875> (PRT-13875) For SCREWTERMINALS and SPRING TERMINALS visit here: Screw Terimnals on SparkFun.com <https://www.sparkfun.com/search/results?term=Screw+Terminals> (5mm/3.5mm/2.54mm spacing) This device is also useful as a general connection point to wire up your design to another part of your project. Our various solder wires solder well into these plated through hole pads. Hook-Up Wire - Assortment (Stranded, 22 AWG) <https://www.sparkfun.com/products/11375> (PRT-11375) Hook-Up Wire - Assortment (Solid Core, 22 AWG) <https://www.sparkfun.com/products/11367> (PRT-11367) View the entire wire category on our website here <https://www.sparkfun.com/categories/141> Special notes: Molex polarized connector foot print use with SKU : PRT-08232 with associated crimp pins and housings.
J35 = Spark:CON_12*2_SMD_HEADER
L1 = RedBear:L
L2 = Particle:INDUCTOR-SPARKFUN: Inductors Basic Inductor/Choke - 0603 and 1206. Footprints are not proven and vary greatly between part numbers. SRN6045- 33uH, 20% 1.4A
L4 = SparkFun-Coils:INDUCTOR: Inductors Resist changes in electrical current. Basically a coil of wire. SparkFun Products: SparkFun Load Cell Amplifier - HX711 <https://www.sparkfun.com/products/13879> IOIO-OTG - V2.2 <https://www.sparkfun.com/products/13613>; PROD_ID: NDUC-13076; VALUE: 3.3µH/±20%/450mA
L7 = Particle:INDUCTOR
LED1 LED2 = particle SZ:LED: LED
NFC = Particle:IPEX-20279-001E: Ultra Miniature Coaxial SMT RF Receptacle
P1-P4 = MESH SOM EVAL BOARD:SPARK_POGOPIN: pogopin-2.0mm
Q2 Q3 = RedBear:PMOS: PMOS
R2 R3 R10 R11 R34 R35 = Spark:R-US_: 0402 Resistor
R16 = SparkFun-Passives:RESISTOR: Resistor Basic schematic elements and footprints for 0603, 1206, and PTH resistors.
R19 R23-R26 R30-R33 R36 R39-R49 R51 R53-R57 R59 R60 = Particle:R-US_: 0402 Resistor
R61 = resistor:R-EU_: RESISTOR, European symbol
RGB = Particle:RGB-LED-CLMVB-FKA: CREE CLMVB-FKA RGB LED 2mm x 2mm
RJ45 = L12.0:ARDUINO-ETHERNET-SHIELD2-V2_POE_RJ45
RN1 RN2 = resistor-dil:4R-N: Array Chip Resistor Source: RS Component / Phycomp; OC_FARNELL: unknown; OC_NEWARK: unknown
S1 S4 = SparkFun-Retired:SWITCH-DPDT: DPDT Version of the COM-00597
TP1 TP2 TP4-TP54 = testpad:TPS: TEST PIN
TP3 = particle SZ:TP
U1 = W5500_Ethernet_shield_v10:W5500
U2 = Particle:XC8107
U3 = Particle:XC9258: 1.0A Synchronous Step-Down DC/DC Converters
U13 = SparkFun-PowerIC:MAX1704X: MAX17043/MAX17044: Battery Fuel Guage (43 is 1cell, 44 is 2cell)
U14 = electron:BQ24298RTWR: Bq24298 I2C Controlled 3A Single Cell USB Charger with Narrow VDC Power Path Management and Adjustable Voltage USB OTG
U$1 U$2 U$9-U$12 = Spark:TP: Test Points of all sizes and shapes
USB1 USB2 = RedBear:MICRO_USB: Micro-USB
X1 X3 = con-coax:BU-SMA-G: FEMALE SMA CONNECTOR Radiall distributor RS 193-9117; OC_FARNELL: unknown; OC_NEWARK: unknown
X4 = Connettori:0046_15TW-882: SD CARD MICRO SMD-15TW-15882; MONTHLY_USAGE: 9256.37; PART_NUMBER: 15TW-882 REEL; PRICE: 0.52; SUPPLIER: La_Tecnika_Due_s.r.l.; TYPE: Connettori; VALUE: SDCARD-15TW-882
Y1 = SparkFun-Clocks:CRYSTAL-GROUNDED: Crystals w/ Ground Pin (Generic) These are passive quartz crystals, which can be used as a clock source for a microcontroller. Crystal's are usually two-terminal devices. A third terminal may be optionally connected to ground, as recommended by the manufaturer.
Z1-Z6 = supressor:PESD: ESD SUPPRESSOR Polymeric ESD Suppressor, Raychem PESD Series

## Net classes
0 default: width 0.152 mm, clearance 0.152 mm
1 power: width 0.254 mm, drill 0.61 mm, clearance 0.203 mm
3 BAT: clearance 0.203 mm
4 3V3: width 0.305 mm, clearance 0.508 mm
6 +3V3: width 0.203 mm, clearance 0.152 mm